# EAGLE design YOTSUBA_AP_EM_ver.3.0 (EAGLE 9.6.2)
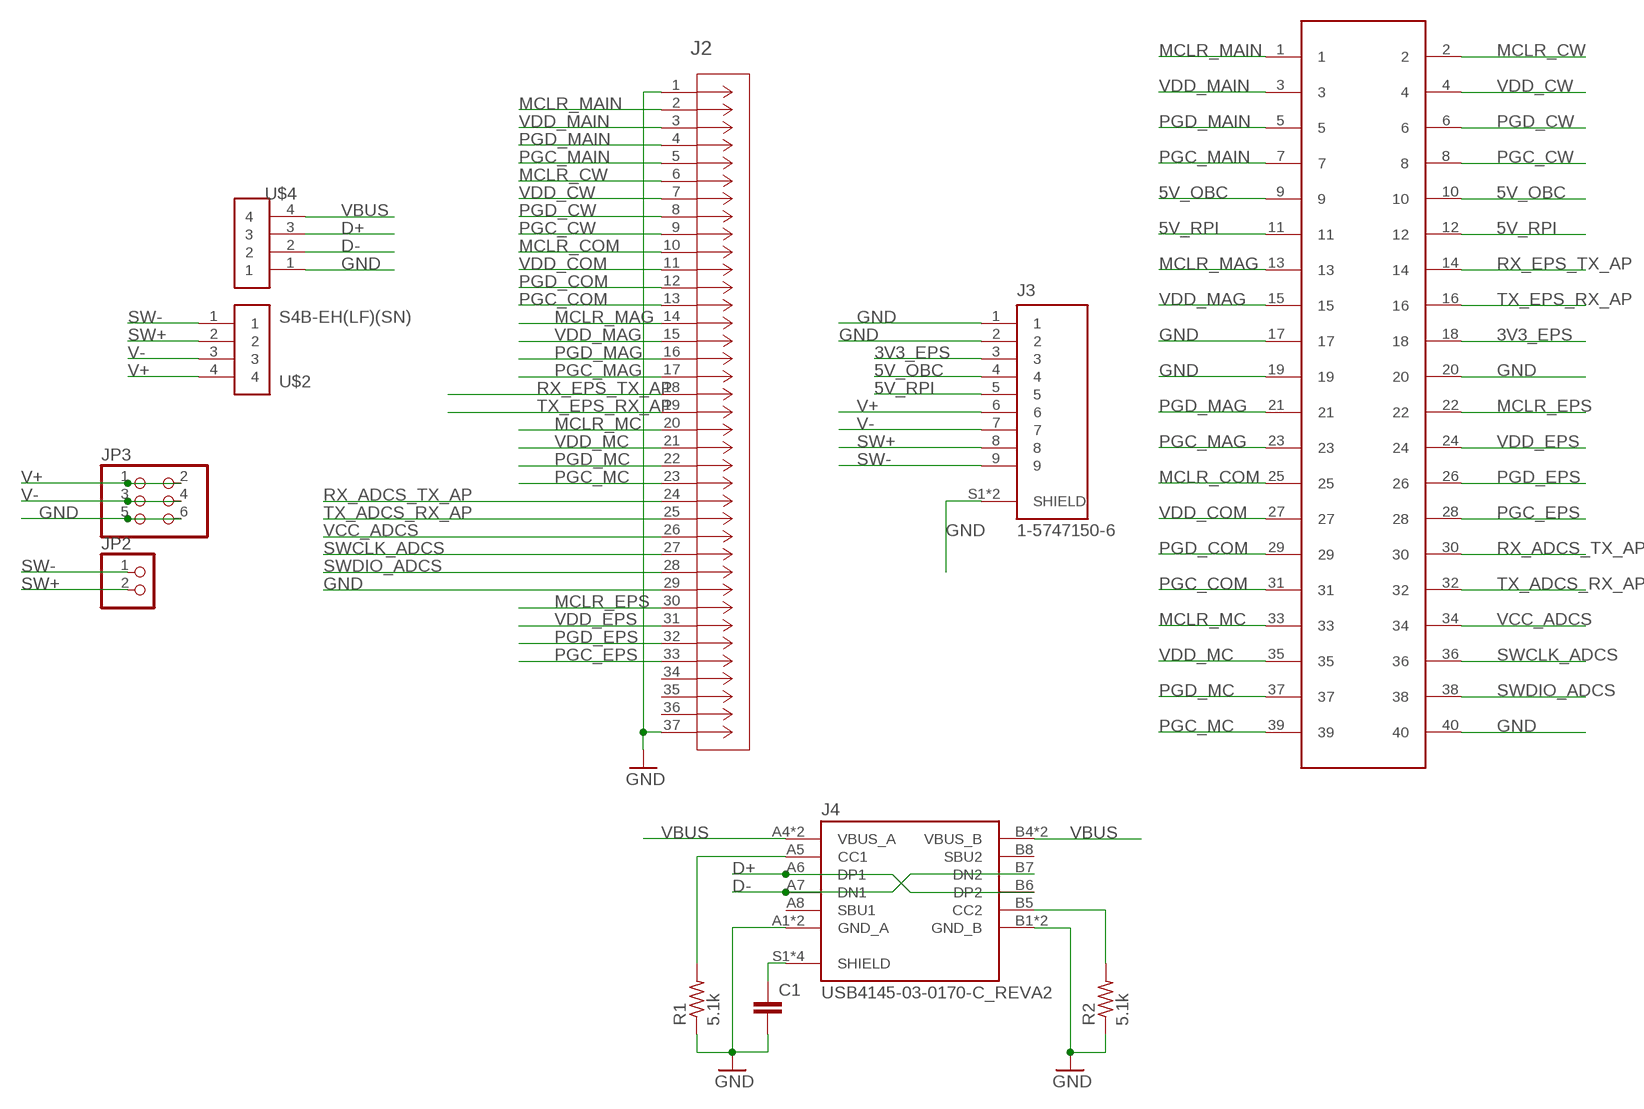
[diagram p0: schematic, sheet 1]

## Parts
C1  C-EUC2012  [C2012]
J2  1-5747301-6  [CONN_1-5747301-6_TYC]
J3  1-5747150-6  [TE_1-5747150-6]
J4  USB4145-03-0170-C_REVA2  [GCT_USB4145-03-0170-C_REVA2]
JP2  PINHD-1X2  [1X02]
JP3  PINHD-2X3  [2X03]
R1  5.1k  R-US_R0805  [R0805]
R2  5.1k  R-US_R0805  [R0805]
U$1  M50-3902042  [M50-3902042]
U$2  S4B-EH(LF)(SN)  [JST_S4B-EH(LF)(SN)]
U$4  S4B-EH(LF)(SN)  [JST_S4B-EH(LF)(SN)]

## Nets
3V3_EPS: J3.3 U$1.18
5V_OBC: J3.4 U$1.9 U$1.10
5V_RPI: J3.5 U$1.11 U$1.12
D+: J4.A6(DP1) J4.B6(DP2) U$4.3
D-: J4.A7(DN1) J4.B7(DN2) U$4.2
GND [gnd]: C1.2 J2.1 J2.29 J2.37 J3.1 J3.2 J3.S1(SHIELD) J3.S2(SHIELD) J4.A1(GND_A) J4.A12(GND_A) J4.B1(GND_B) J4.B12(GND_B) JP3.5 JP3.6 R1.1 R2.1 U$1.17 U$1.19 U$1.20 U$1.40 U$4.1
MCLR_COM: J2.10 U$1.25
MCLR_CW: J2.6 U$1.2
MCLR_EPS: J2.30 U$1.22
MCLR_MAG: J2.14 U$1.13
MCLR_MAIN: J2.2 U$1.1
MCLR_MC: J2.20 U$1.33
N$1: C1.1 J4.S1(SHIELD) J4.S2(SHIELD) J4.S3(SHIELD) J4.S4(SHIELD)
N$2: J4.A5(CC1) R1.2
N$3: J4.B5(CC2) R2.2
PGC_COM: J2.13 U$1.31
PGC_CW: J2.9 U$1.8
PGC_EPS: J2.33 U$1.28
PGC_MAG: J2.17 U$1.23
PGC_MAIN: J2.5 U$1.7
PGC_MC: J2.23 U$1.39
PGD_COM: J2.12 U$1.29
PGD_CW: J2.8 U$1.6
PGD_EPS: J2.32 U$1.26
PGD_MAG: J2.16 U$1.21
PGD_MAIN: J2.4 U$1.5
PGD_MC: J2.22 U$1.37
RX_ADCS_TX_AP: J2.24 U$1.30
RX_EPS_TX_AP: J2.18 U$1.14
SW+ [pwr]: J3.8 JP2.2 U$2.2
SW- [pwr]: J3.9 JP2.1 U$2.1
SWCLK_ADCS: J2.27 U$1.36
SWDIO_ADCS: J2.28 U$1.38
TX_ADCS_RX_AP: J2.25 U$1.32
TX_EPS_RX_AP: J2.19 U$1.16
V+ [pwr]: J3.6 JP3.1 JP3.2 U$2.4
V- [pwr]: J3.7 JP3.3 JP3.4 U$2.3
VBUS: J4.A4(VBUS_A) J4.A9(VBUS_A) J4.B4(VBUS_B) J4.B9(VBUS_B) U$4.4
VCC_ADCS: J2.26 U$1.34
VDD_COM: J2.11 U$1.27
VDD_CW: J2.7 U$1.4
VDD_EPS: J2.31 U$1.24
VDD_MAG: J2.15 U$1.15
VDD_MAIN: J2.3 U$1.3
VDD_MC: J2.21 U$1.35
Unconnected: J2.34 J2.35 J2.36 J4.A8(SBU1) J4.B8(SBU2)

## Library data of the parts
C1 = rcl:C-EU: CAPACITOR, European symbol; SPICEPREFIX: C
J2 = 1-5747301-6:1-5747301-6; COPYRIGHT: Copyright (C) 2023 Ultra Librarian. All rights reserved.; MANUFACTURER_PART_NUMBER: 1-5747301-6; MFR_NAME: TE Connectivity
J3 = 1-5747150-6:1-5747150-6: 09 RCPT SP/FMS SCRLK Check availability <https://pricing.snapeda.com/parts/1-5747150-6/TE%20Connectivity/view-part?ref=eda>; AVAILABILITY: In Stock; CENTERLINE_PITCH: 2.74 mm[.108 in]; COMMENT: 1-5747150-6; DESCRIPTION: 9 Position D-Sub Receptacle, Female Sockets Connector; MF: TE Connectivity; MP: 1-5747150-6; NUMBER_OF_POSITIONS: 9; PACKAGE: None; PRICE: None; PRODUCT_TYPE: Connector; PURCHASE-URL: https://pricing.snapeda.com/search/part/1-5747150-6/?ref=eda
J4 = USB4145-03-0170-C_REVA2:USB4145-03-0170-C_REVA2: Check availability <https://pricing.snapeda.com/parts/USB4145-03-0170-C/Global%20Connector%20Technology/view-part?ref=eda>; AVAILABILITY: In Stock; DESCRIPTION: Type C USB 2.0 Connector; MF: Global Connector Technology; MP: USB4145-03-0170-C; PACKAGE: None; PRICE: None
JP2 = pinhead:PINHD-1X2: PIN HEADER
JP3 = pinhead:PINHD-2X3: PIN HEADER
R1 R2 = rcl:R-US_: RESISTOR, American symbol; SPICEPREFIX: R
U$1 = MITSUBA_Connectors-v4.0:M50-3902042: 40pins 1.27mm pitch 2line pinheader
U$2 U$4 = S4B-EH_LF__SN_:S4B-EH(LF)(SN): EH Series 4 Position 2.5 mm Side Entry Single Row Shrouded Header Check availability <https://pricing.snapeda.com/parts/S4B-EH%28LF%29%28SN%29/JST%20Sales/view-part?ref=eda>; AVAILABILITY: In Stock; DESCRIPTION: Connector Header Through Hole, Right Angle 4 position 0.098 (2.50mm); MF: JST Sales; MP: S4B-EH(LF)(SN); PACKAGE: None; PRICE: None; PURCHASE-URL: https://pricing.snapeda.com/search/part/S4B-EH(LF)(SN)/?ref=eda

## Net classes
0 default: clearance 0.254 mm
1 gnd: clearance 0.559 mm
2 pwr: clearance 0.229 mm
3 gnd_usb: clearance 0.025 mm

## Board
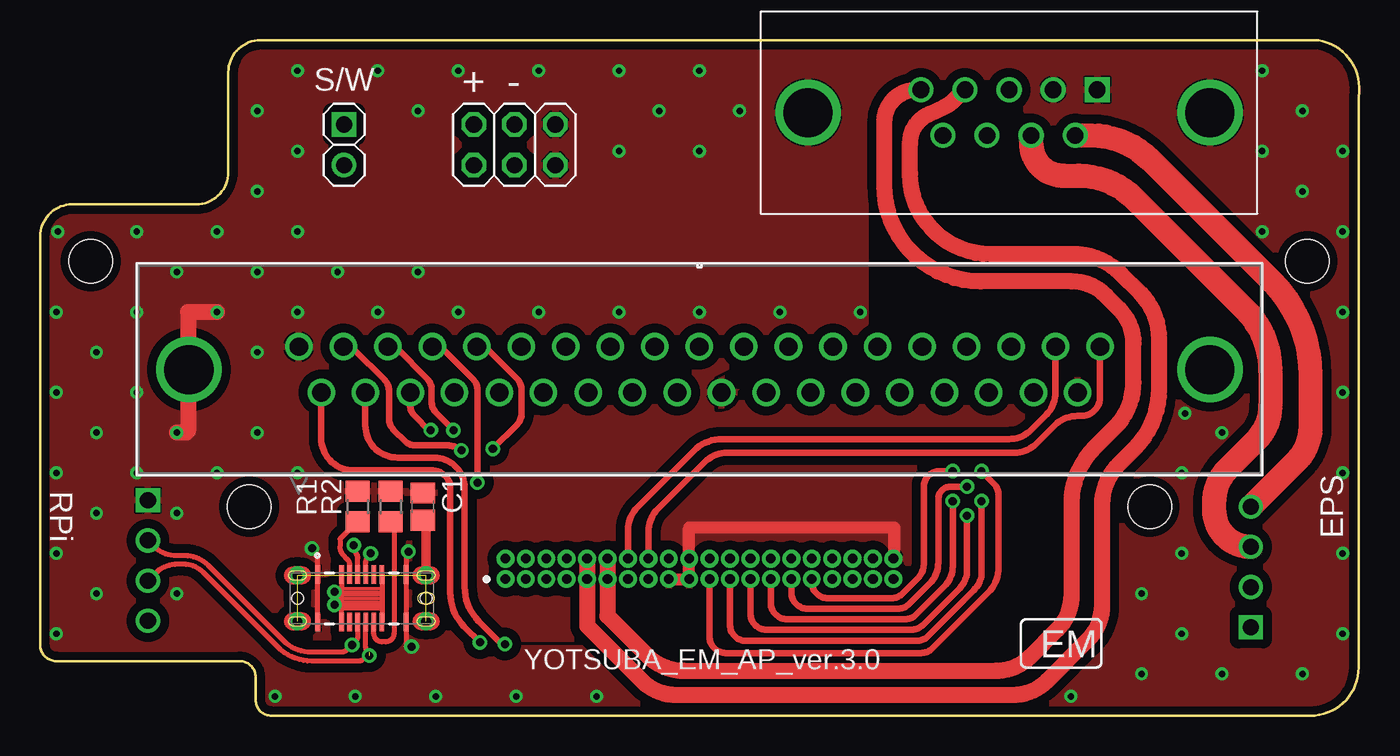
[diagram p1: board, top side]
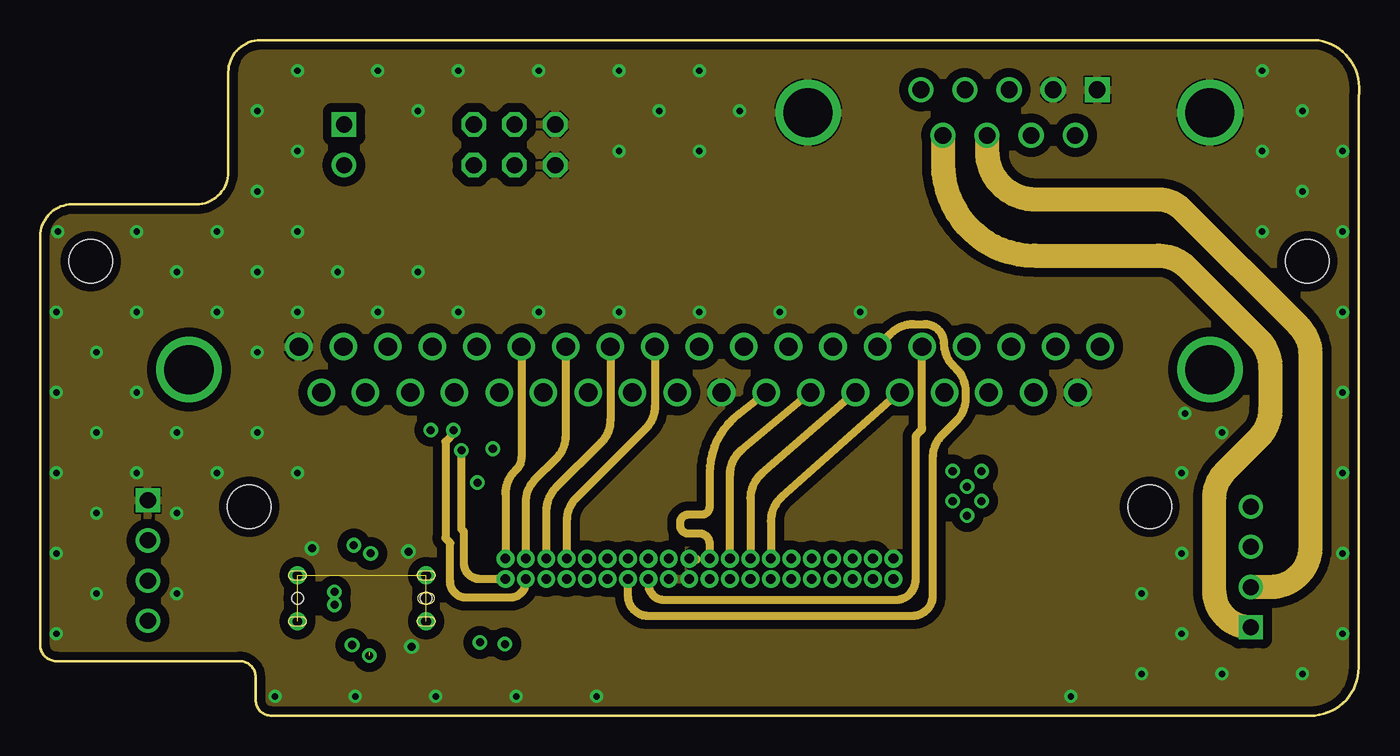
[diagram p2: board, inner layer Route2]
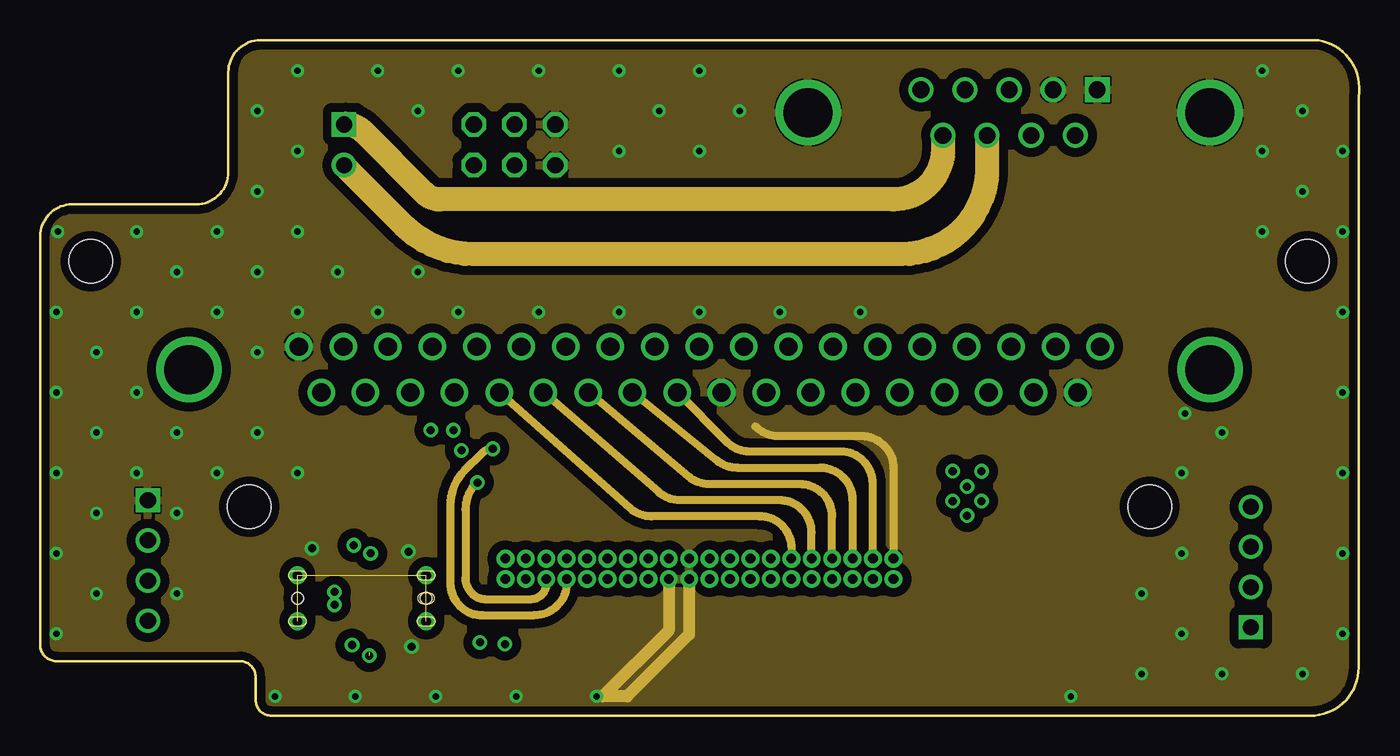
[diagram p3: board, inner layer Route15]
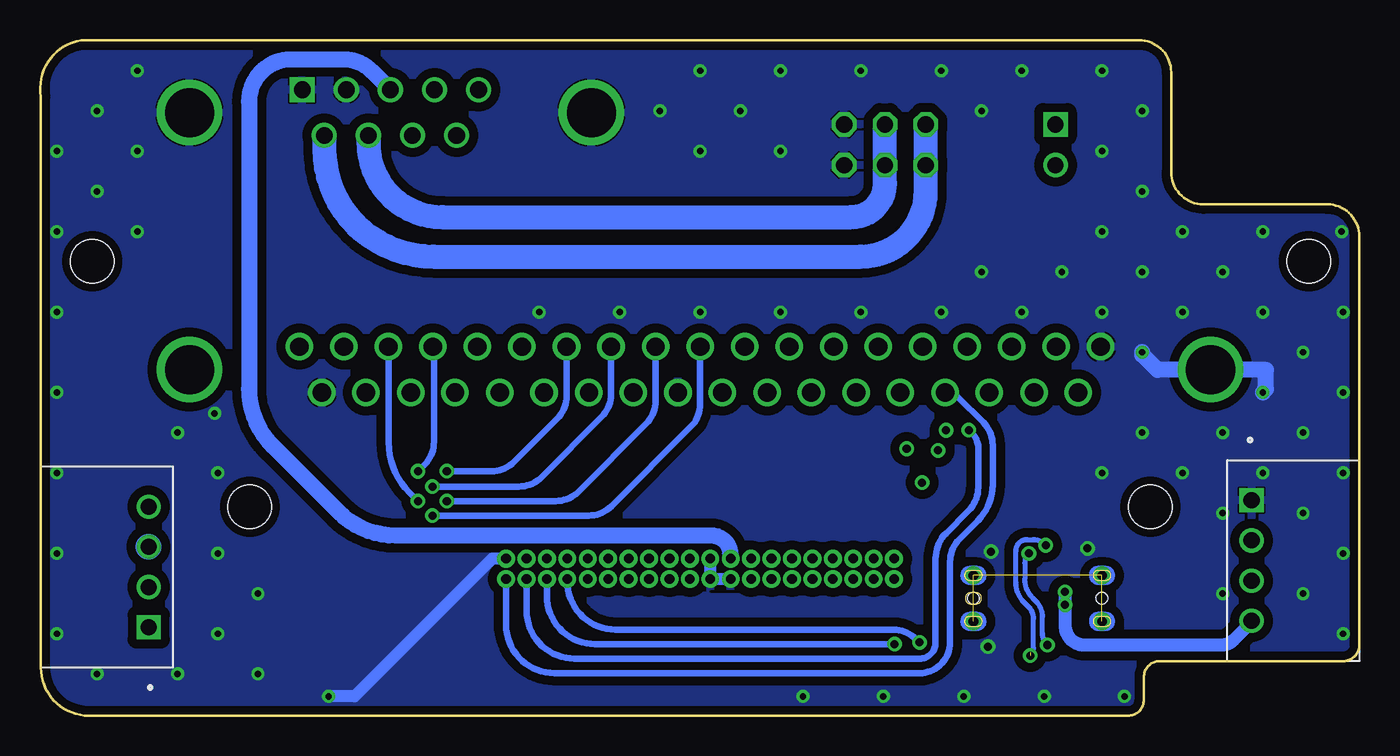
[diagram p4: board, bottom side, seen from below]

Size 82.04 x 42 mm. Coordinates in mm from the lower left corner, seen from the top.
Outline: 0,4.4 0,29.8 arc-90 2,31.8 9.7,31.8 arc90 11.7,33.8 11.7,40 arc-90 13.7,42 79.5,42 arc-90 82,38.5 82,3 arc-90 79,0 14.4,0 arc-90 13.4,1 13.4,2.4 arc90 12.4,3.4 1,3.4 arc-90 0,4.4
Copper layers (1+2*15+16): Top 0.035mm / dielectric 1.5mm / Route2 0.035mm / dielectric 0.15mm / Route15 0.035mm / dielectric 0.2mm / Bottom 0.035mm
Design rules "default *": minimum track width 6mil, minimum drill 0.35mm, track to track 6mil, track to pad 6mil, pad to pad 6mil, via to via 6mil, smd to smd 6mil, copper to edge 20mil, drill to drill 6mil, minimum pad ring 10mil, minimum via ring 8mil, stop-mask expansion 4mil, vias tented up to drill 0mil, thermal gap 4mil
Holes 2.7 mm at 13,13 69,13 78.8,28.25 3.15,28.25
tRestrict: 10 lines
bRestrict: 4 lines

### Footprints (pad centres in the part's own frame; a part is rotated, then mirrored left to right if it is on the bottom)
C2012 = smd 1.3 x 1.5: 1 -0.85,0; 2 0.85,0
CONN_1-5747301-6_TYC = drill 1.143 pad 1.651: 1 -24.917,-5.055; 2 -22.149,-5.055; 3 -19.38,-5.055; 4 -16.612,-5.055; 5 -13.843,-5.055; 6 -11.074,-5.055; 7 -8.306,-5.055; 8 -5.537,-5.055; 9 -2.769,-5.055; 10 0,-5.055; 11 2.769,-5.055; 12 5.537,-5.055; 13 8.306,-5.055; 14 11.074,-5.055; 15 13.843,-5.055; 16 16.612,-5.055; 17 19.38,-5.055; 18 22.149,-5.055; 19 24.917,-5.055; 20 -23.52,-7.899; 21 -20.777,-7.899; 22 -17.983,-7.899; 23 -15.24,-7.899; 24 -12.446,-7.899; 25 -9.703,-7.899; 26 -6.909,-7.899; 27 -4.166,-7.899; 28 -1.372,-7.899; 29 1.372,-7.899; 30 4.166,-7.899; 31 6.909,-7.899; 32 9.703,-7.899; 33 12.446,-7.899; 34 15.24,-7.899; 35 17.983,-7.899; 36 20.777,-7.899; 37 23.52,-7.899 | drill 3.048 pad 3.048: 38 -31.75,-6.477; 39 31.75,-6.477
TE_1-5747150-6 = drill 1.04 square: 1 5.485,1.42 | drill 1.04: 2 2.745,1.42; 3 0.005,1.42; 4 -2.735,1.42; 5 -5.475,1.42; 6 4.115,-1.42; 7 1.375,-1.42; 8 -1.365,-1.42; 9 -4.105,-1.42 | drill 3.05: S1 -12.495,0; S2 12.495,0
GCT_USB4145-03-0170-C_REVA2 = smd 0.3 x 1.15: A1 -2.75,1.485; A4 -1.25,1.485; A5 -0.75,1.485; A6 -0.25,1.485; A7 0.25,1.485; A8 0.75,1.485; A9 1.25,1.485; A12 2.75,1.485; B1 2.75,-1.485; B4 1.25,-1.485; B5 0.75,-1.485; B6 0.25,-1.485; B7 -0.25,-1.485; B8 -0.75,-1.485; B9 -1.25,-1.485; B12 -2.75,-1.485 | drill 0.6 pad 1.1: S1 -4,1.43; S2 4,1.43; S3 -4,-1.43; S4 4,-1.43 | hole 0.71: -4,0; 4,0
1X02 = drill 1.016 square: 1 -1.27,0 | drill 1.016: 2 1.27,0
2X03 = drill 1.016 octagon: 1 -2.54,-1.27; 2 -2.54,1.27; 3 0,-1.27; 4 0,1.27; 5 2.54,-1.27; 6 2.54,1.27
R0805 = smd 1.3 x 1.5: 1 -0.95,0; 2 0.95,0
M50-3902042 = drill 0.6: 1 0,0; 2 0,1.27; 3 1.27,0; 4 1.27,1.27; 5 2.54,0; 6 2.54,1.27; 7 3.81,0; 8 3.81,1.27; 9 5.08,0; 10 5.08,1.27; 11 6.35,0; 12 6.35,1.27; 13 7.62,0; 14 7.62,1.27; 15 8.89,0; 16 8.89,1.27; 17 10.16,0; 18 10.16,1.27; 19 11.43,0; 20 11.43,1.27; 21 12.7,0; 22 12.7,1.27; 23 13.97,0; 24 13.97,1.27; 25 15.24,0; 26 15.24,1.27; 27 16.51,0; 28 16.51,1.27; 29 17.78,0; 30 17.78,1.27; 31 19.05,0; 32 19.05,1.27; 33 20.32,0; 34 20.32,1.27; 35 21.59,0; 36 21.59,1.27; 37 22.86,0; 38 22.86,1.27; 39 24.13,0; 40 24.13,1.27
JST_S4B-EH(LF)(SN) = drill 1 pad 1.5 square: 1 0,0 | drill 1 pad 1.5: 2 2.5,0; 3 5,0; 4 7.5,0

### Placement (x,y rotation side)
C1  23.8,13 90 top
J2  41,28 0 top
J3  60.26,37.5 0 top
J4  20,7.3 0 top
JP2  18.9,35.5 270 top
JP3  29.5,35.5 0 top
R1  19.75,13 270 top
R2  21.8,13 270 top
U$1  28.93,8.5 0 top
U$2  75.3,5.5 90 bottom
U$4  6.7,13.4 270 bottom

### Tracks (layer width: path | path; a pad name or v marks a point on that pad's centre or on a via)
3V3_EPS
  Bottom 1: U$1.18 arc-90 39.1,9.78 39.1,10.01 arc-90 40.3,11.2 59.93,11.2 arc45 63.46,12.66 67.59,16.79 arc45 69.05,20.32 69.05,38.2 arc90 66.45,40.8 63.14,40.8 arc45 61.43,40.09 J3.3
5V_OBC
  Top 1: U$1.10 U$1.9 34.02,5.58 37.42,2.18 arc45 39.54,1.3 60.51,1.3 arc45 62.63,2.18 65.17,4.72 arc45 66.05,6.84 66.05,13.11 arc-45 67.1,15.65 68.06,16.61 arc45 69.6,20.32 69.6,23.42 arc45 68.41,26.29 67.22,27.48 arc45 64.28,28.7 59.1,28.7 arc-90 54.1,33.7 54.1,35.59 arc-66 55.28,37.41 56.21,37.83 arc21 56.8,38.24 57.48,38.92 J3.4
5V_RPI
  Top 1: U$1.12 U$1.11 35.28,6.21 37.78,3.72 arc45 40,2.8 59.46,2.8 arc45 61.58,3.68 63.27,5.37 arc45 64.15,7.49 64.15,13.18 arc-45 65.61,16.71 66.85,17.95 arc45 68,20.73 68,23.16 arc45 67.12,25.28 66.28,26.12 arc45 64.16,27 58.5,27 arc-90 52.5,33 52.5,36.92 arc-90 54.5,38.92 J3.5
D+  (via drill 0.5)  (1 unrouted)
  Top 0.3: J4.B6 20.25,4.26 arc45 20.4,3.9 20.46,3.84 v20.46,3.74 | 20.45,3.95 20.45,3.85 20.15,3.55 arc-45 19.79,3.4 16.89,3.4 arc-45 14.77,4.28 10.12,8.93 arc45 8.92,9.43 8.55,9.43 arc45 7.14,8.84 U$4.3 | J4.A6 19.75,9.8 arc22 19.71,9.99 19.5,10.51 arc-45 v19.5,10.6
  Bottom 0.3: v20.46,3.74 arc-45 20.26,4.23 20.26,6.05 arc-45 20.55,6.75 20.84,7.04 arc45 21.36,8.29 21.36,10.26 arc90 20.66,10.96 20.27,10.96 arc45 19.56,10.66 v19.5,10.6
D-  (via drill 0.5)
  Top 0.3: J4.A7 20.25,9.54 arc-45 20.43,9.98 v20.55,10.1 | J4.B7 19.75,4.96 arc-45 19.6,4.6 v19.4,4.4 19.15,4.15 arc-45 18.67,3.95 16.85,3.95 arc-45 15.14,4.66 10.44,9.36 arc45 9.02,9.95 8.48,9.95 arc-45 7.06,10.54 U$4.2
  Bottom 0.3: v19.4,4.4 v19.41,4.41 arc45 19.7,5.11 19.7,6.17 arc-45 20.08,7.08 20.31,7.31 arc45 20.8,8.5 20.8,9.5 arc45 v20.55,10.1
GND  (via drill 0.4, 0.5)
  Top 0.3: J4.B12 J4.A1 17.25,9.85 16.9,10.2 v16.9,10.4 | v22.9,10.2 22.75,10.05 J4.A12 J4.B1 22.75,4.3 v23.1,4.3
  Top 0.75: U$1.17 U$1.19 U$1.20 40.37,11.7 53.1,11.7 53.1,9.8
  Top 1: v11,25.1 9.2,25.1 9.2,17.71 9.09,17.6 v8.5,17.6
  Route15 0.5: 44.49,17.99 arc45 45.9,17.4 51.06,17.4 arc-90 53.06,15.4 U$1.40
  Route15 0.75: U$1.19 40.37,5.07 36.5,1.2 v34.6,1.2 35,1.2 39.09,5.29 U$1.17
  Bottom 0.75: U$1.40 53.93,9.77 62.5,1.2 v64.1,1.2 | U$1.17 U$1.19 U$1.20
  Bottom 1: v6,20.1 5.8,20.3 5.8,21.5 12.56,21.5 13.5,22.44 v13.5,22.6
  other vias: 41,25.1 36,25.1 46,25.1 51,25.1 31,25.1 26,25.1 21,25.1 16,25.1 13.5,17.6 3.5,17.6 1,20.1 3.5,22.6 1,25.1 6,25.1 8.5,27.6 6,30.1 1.1,30.1 13.5,27.6 18.5,27.6 16,30.1 23.5,27.6 11,30.1 13.5,32.6 13.5,37.6 16,40.1 16,35.1 21,40.1 26,40.1 23.5,37.6 31,40.1 36,40.1 36,35.1 38.5,37.6 41,35.1 43.5,37.6 78.5,37.6 81,35.1 76,35.1 78.5,32.6 76,30.1 81,30.1 81,25.1 81,20.1 81,15.1 81,10.1 81,5.1 78.5,2.6 73.5,2.6 68.5,2.6 71,5.1 68.5,7.6 71,10.1 71,15.1 73.5,17.6 71.2,18.8 16,15.1 11,15.1 8.5,12.6 3.5,12.6 6,15.1 3.5,7.6 1,10.1 1,5.1 8.5,7.6 1,15.1 14.6,1.2 19.6,1.2 24.6,1.2 29.6,1.2 41,40.1 76,40.1
  pour Bottom: -3.31,42.21 80.53,42.21 arc-90 82.53,40.21 82.53,-4.02 -3.31,-4.02
  pour Top: -1.9,42.7 -1.9,-3.5 83.8,-3.5 83.8,42.7
  pour Route15: -4.2,44.3 -4.2,-2 arc90 -3.2,-3 84,-3 arc90 85,-2 85,44.3 arc90 84,45.3 -3.2,45.3 arc90
  pour Route2: -3.1,-6.3 -3.1,46.6 arc-90 -2.1,47.6 86.1,47.6 arc-90 87.1,46.6 87.1,-6.3 arc-90 86.1,-7.3 -2.1,-7.3 arc-90
MCLR_COM  (via drill 0.5)
  Top 0.4: U$1.25 44.17,6.35 arc90 45.17,5.35 54.19,5.35 arc45 54.89,5.64 57.19,7.94 arc45 57.65,9.05 v57.65,12.44
  Bottom 0.4: J2.10 41,19.38 arc45 41.59,17.96 46.52,13.03 arc45 47.94,12.44 v57.65,12.44
MCLR_CW
  Route2 0.5: J2.6 29.93,16.04 arc-45 29.63,15.33 29.52,15.22 arc45 28.93,13.81 U$1.2
MCLR_EPS
  Route2 0.5: J2.30 43.41,18.73 arc52 41.63,15.1 41.63,13 arc-90 41.13,12.5 40.3,12.5 arc90 39.8,12 39.8,11.83 arc90 40.3,11.33 41,11.33 arc-90 41.63,10.7 U$1.22 | 40.73,9.77 40.8,9.7 40.85,9.7 40.78,9.77 40.73,9.77
MCLR_MAG
  Route2 0.5: J2.14 52.89,23.76 arc-45 54.31,24.35 55.02,24.35 arc-90 56.2,23.17 arc45 56.79,21.76 56.97,21.58 arc-45 57.55,20.16 57.55,19.73 arc-45 56.97,18.32 56.09,17.44 arc45 55.5,16.02 55.5,7.47 arc-90 54.23,6.2 37.83,6.2 arc-90 36.55,7.47 U$1.13
MCLR_MAIN  (via drill 0.5)
  Top 0.4: J2.2 19.14,22.95 arc-45 19.51,22.79 21.41,20.89 arc-45 21.7,20.19 21.7,18.46 arc45 21.99,17.76 22.65,17.1 arc45 23.36,16.8 25.39,16.8 arc-45 26.09,16.51 26.1,16.5 v26.2,16.5
  Route2 0.5: U$1.1 27.35,8.5 arc-90 26.35,9.5 26.35,11.45 26.2,11.6 v26.2,16.5
MCLR_MC  (via drill 0.5)
  Top 0.4: v27.35,4.56 26.38,5.53 arc-45 25.5,7.65 25.5,14.15 arc90 24.4,15.25 19.48,15.25 arc-90 17.48,17.25 J2.20
  Bottom 0.4: U$1.33 49.26,8.35 arc-90 46.26,5.35 28.97,5.35 arc45 27.56,4.76 v27.35,4.56
N$1  (3 unrouted)
  Top 0.3: 24,11.95 C1.1
  Top 0.6: J4.S2 24,11.95
N$2
  Top 0.3: J4.A5 19.25,9.38 arc45 19.1,9.73 18.87,9.97 arc-45 18.65,10.49 18.65,11 19.7,12.05 R1.2
N$3
  Top 0.3: J4.B5 20.75,5.1 arc90 21.25,4.6 21.5,4.6 arc90 22,5.1 22,11.79 21.99,11.8 21.99,11.86 R2.2
PGC_COM  (via drill 0.5)
  Top 0.4: U$1.31 47.98,8.31 arc90 48.98,7.31 52.95,7.31 arc45 53.65,7.6 54.59,8.54 arc45 54.95,9.41 54.95,14.21 arc-90 55.95,15.21 v56.75,15.21
  Bottom 0.4: J2.13 49.31,19.87 arc45 49.89,18.46 52.56,15.79 arc45 53.98,15.2 v56.74,15.2 v56.75,15.21
PGC_CW
  Route2 0.5: J2.9 38.23,19.26 arc-45 37.65,17.85 33.33,13.53 arc45 32.74,12.12 U$1.8
PGC_EPS
  Route2 0.5: U$1.28 45.45,12.1 arc-48 46.12,13.6 53.43,20.1 J2.33
PGC_MAG  (via drill 0.5)
  Top 0.4: U$1.23 42.91,5.65 arc90 43.91,4.65 54.51,4.65 arc45 55.22,4.94 58.09,7.81 arc45 58.55,8.93 v58.55,13.35
  Bottom 0.4: J2.17 60.37,22.94 60.37,17 arc-45 59.08,13.88 v58.55,13.35
PGC_MAIN  (via drill 0.5)
  Top 0.4: v28.15,16.6 29.66,18.11 arc45 29.95,18.81 29.95,20.24 arc45 29.66,20.94 27.95,22.65 arc45 27.24,22.95 J2.5
  Route15 0.5: U$1.7 32.74,8.25 arc-90 30.75,6.25 27.5,6.25 arc-90 25.5,8.25 25.5,13.11 arc-45 26.38,15.23 27.47,16.32 arc-45 v28.15,16.6
PGC_MC
  Bottom 0.4: U$1.39 53.06,5.65 arc-90 50.06,2.65 27.35,2.65 arc-90 25.45,4.55 25.45,9.57 arc45 24.86,10.99 23.73,12.12 arc-45 22.8,14.36 22.8,16.82 arc-45 23.39,18.24 24.96,19.81 arc-45 25.66,20.1 J2.23
PGD_COM  (via drill 0.5)
  Top 0.4: U$1.29 46.72,7.66 arc90 47.72,6.66 53.34,6.66 arc45 54.05,6.95 55.32,8.22 arc45 55.85,9.51 55.85,13.45 arc-90 56.65,14.25 v57.65,14.25
  Bottom 0.4: J2.12 46.54,19.99 arc45 47.12,18.58 50.86,14.84 arc45 52.28,14.25 v57.65,14.25
PGD_CW
  Route2 0.5: U$1.6 31.48,12.75 arc-45 32.06,14.16 34.88,16.98 arc45 35.46,18.39 J2.8
PGD_EPS
  Route2 0.5: J2.32 44.87,15.04 arc49 44.17,13.53 U$1.26
PGD_MAG  (via drill 0.5)
  Top 0.4: U$1.21 41.63,4.9 arc90 42.63,3.9 54.79,3.9 arc45 55.49,4.19 58.97,7.67 arc45 59.61,9.2 59.61,13.73 arc45 59.31,14.44 v58.55,15.2
  Bottom 0.4: v58.55,15.2 58.14,15.61 arc-45 57.55,17.03 57.55,22.89 J2.16
PGD_MAIN  (via drill 0.5)
  Top 0.4: v27.2,14.5 27.2,20.24 arc45 26.91,20.94 24.91,22.95 J2.4
  Route15 0.5: U$1.5 31.48,8.2 arc-90 30.52,7.24 27.75,7.24 arc-90 26.45,8.54 26.45,12.81 arc-45 27.15,14.5 v27.2,14.5
PGD_MC  (via drill 0.5)
  Top 0.4: v24.29,17.76 24.16,17.76 23.31,18.61 arc-45 23.02,19.32 J2.22
  Bottom 0.4: U$1.37 51.8,6.55 arc-90 48.8,3.55 27.35,3.55 arc-90 26.35,4.55 26.35,9.77 arc45 25.69,11.36 24.3,12.75 arc-45 23.7,14.2 23.7,16.68 arc-45 24.04,17.51 v24.29,17.76
RX_ADCS_TX_AP
  Route15 0.5: U$1.30 46.74,9.8 46.74,10.4 arc90 44.74,12.4 38.01,12.4 arc-42 36.69,12.9 J2.24
RX_EPS_TX_AP
  Top 0.4: U$1.14 36.56,11.55 arc-45 37.15,12.97 40.65,16.47 arc-45 42.41,17.2 60.23,17.2 arc45 61.65,17.79 62.56,18.7 arc45 63.15,20.11 J2.18
SW+
  Route2 1.5: J3.8 58.89,35.1 arc90 61.89,32.1 69.57,32.1 arc-45 70.99,31.51 78.27,24.23 arc-45 79,22.46 79,10.5 arc-90 76.5,8 U$2.2
  Route15 1.5: J3.8 58.89,34 arc-90 53.59,28.7 26.95,28.7 arc-45 22.6,30.5 18.9,34.2 JP2.2
SW-
  Route2 1.5: J3.9 56.15,34.3 arc90 61.85,28.6 69.56,28.6 arc-45 71.33,27.87 75.77,23.43 arc-45 76.5,21.66 76.5,19.04 arc-45 75.77,17.27 73.73,15.23 arc45 73,13.46 73,7.8 arc90 U$2.1
  Route15 1.5: J3.9 56.15,35.2 arc-90 53.05,32.1 24.85,32.1 arc-45 23.91,32.49 20.07,36.33 arc45 18.93,36.8 JP2.1
SWCLK_ADCS
  Route15 0.5: J2.27 42.11,15.87 arc39 43.36,15.43 48.51,15.43 arc-90 50.51,13.43 50.51,9.78 U$1.36
SWDIO_ADCS
  Route15 0.5: U$1.38 51.78,9.78 51.78,14.43 arc90 49.78,16.43 44.13,16.43 arc-45 42.72,17.01 J2.28
TX_ADCS_RX_AP
  Route15 0.5: U$1.32 47.97,9.78 47.97,11.4 arc90 45.97,13.4 39.79,13.4 arc-41 38.48,13.89 J2.25
TX_EPS_RX_AP
  Top 0.4: J2.19 65.92,19.81 arc-45 65.58,18.98 arc-45 64.75,18.64 64.52,18.64 arc45 63.1,18.05 61.99,16.94 arc-45 60.57,16.35 42.73,16.35 arc45 41.31,15.76 38.41,12.86 arc45 37.83,11.45 U$1.16
V+
  Top 1.5: J3.6 65.36,36.08 arc-45 69.05,34.55 76.56,27.04 arc-45 79,21.15 79,17.94 arc-45 78.12,15.82 U$2.4
  Bottom 1.5: J3.6 64.37,35.21 arc-45 62.45,30.56 arc-45 57.59,28.55 31.01,28.55 arc-90 26.96,32.6 JP3.1 JP3.2
V-
  Top 1.5: J3.7 61.63,35.58 arc90 63.63,33.58 64.58,33.58 arc-45 68.06,32.14 74.91,25.29 arc-45 76.5,21.46 76.5,19.24 arc-45 75.62,17.12 73.88,15.38 arc45 73,13.26 73,12.8 arc90 U$2.3
  Bottom 1.5: J3.7 61.63,35.6 arc-90 57.03,31 31.6,31 arc-90 29.5,33.1 JP3.3 JP3.4
  Bottom 1.6: 75.32,10.52 U$2.3
VBUS  (via drill 0.5)
  Top 0.2: 21.25,7.9 18.75,7.9 18.6,7.9 | 18.75,7.7 21.25,7.7 | 21.25,7.3 18.75,7.3 18.75,7.5 21.25,7.5 | 18.75,7.1 21.25,7.1 21.25,7 | 21.25,6.9 18.75,6.9 18.75,6.8 21.25,6.8 21.25,6.7 | 21.25,6.6 21.25,6.64 18.75,6.64 | 18.6,6.64 18.75,6.64 | 18.6,7.9 18.6,6.64 | 18.6,6.64 18.3,6.64 v18.3,6.9 | 18.6,7.9 18.3,7.9 v18.3,7.7
  Top 0.3: J4.A9 21.25,7.9 21.25,7.7 21.25,7.5 21.25,7.3 21.25,7 21.25,6.9 J4.B4 | J4.A4 18.75,7.9 18.75,7.7 18.75,7.5 18.75,7.1 18.75,6.8 18.75,6.64 J4.B9
  Bottom 0.8: v18.3,7.7 v18.3,6.9 18.3,5.61 arc-90 17.1,4.41 8.54,4.41 arc-45 7.83,4.7 6.7,5.84 U$4.4
VCC_ADCS
  Route15 0.5: U$1.34 49.26,12.4 arc90 47.26,14.4 41.62,14.4 arc-40 40.33,14.87 J2.26
VDD_COM  (via drill 0.5)
  Top 0.4: U$1.27 45.45,7 arc90 46.45,6 53.79,6 arc45 54.5,6.3 56.22,8.02 arc45 56.75,9.31 v56.75,13.35
  Bottom 0.4: J2.11 43.77,19.56 arc45 44.35,18.15 48.56,13.94 arc45 49.98,13.35 v56.75,13.35
VDD_CW
  Route2 0.5: U$1.4 30.2,13.28 arc-45 30.79,14.69 32.11,16.01 arc45 32.69,17.42 J2.7
VDD_EPS
  Route2 0.5: U$1.24 42.91,14.99 arc-50 43.62,16.53 J2.31
VDD_MAG
  Route2 0.4: 54.85,22.94 J2.15
  Route2 0.5: U$1.15 37.83,8.2 arc90 38.83,7.2 53.18,7.2 arc90 54.45,8.47 54.45,17.27 arc-45 54.54,17.49 54.76,17.71 arc45 54.85,17.93 54.85,22.94
VDD_MAIN  (via drill 0.5)
  Top 0.4: v25.7,17.75 24.64,18.81 arc-45 24.35,19.51 24.35,20.26 arc45 24.06,20.96 22.16,22.86 arc45 21.96,22.95 J2.3
  Route2 0.5: U$1.3 30.2,8.34 arc-90 29.2,7.34 26.5,7.34 arc-90 25.5,8.34 25.5,10.75 25.2,11.05 25.2,17.05 25.7,17.55 v25.7,17.75
VDD_MC  (via drill 0.5)
  Top 0.4: v28.9,4.45 28.7,4.45 27.28,5.87 arc-45 26.4,7.99 26.4,14.15 arc90 24.5,16.05 22.22,16.05 arc-90 20.22,18.05 J2.21
  Bottom 0.4: U$1.35 50.52,7.45 arc-90 47.52,4.45 v28.9,4.45

### Text on the board
tNames: S/W | + | - | RPi | EPS | YOTSUBA_EM_AP_ver.3.0 | EM